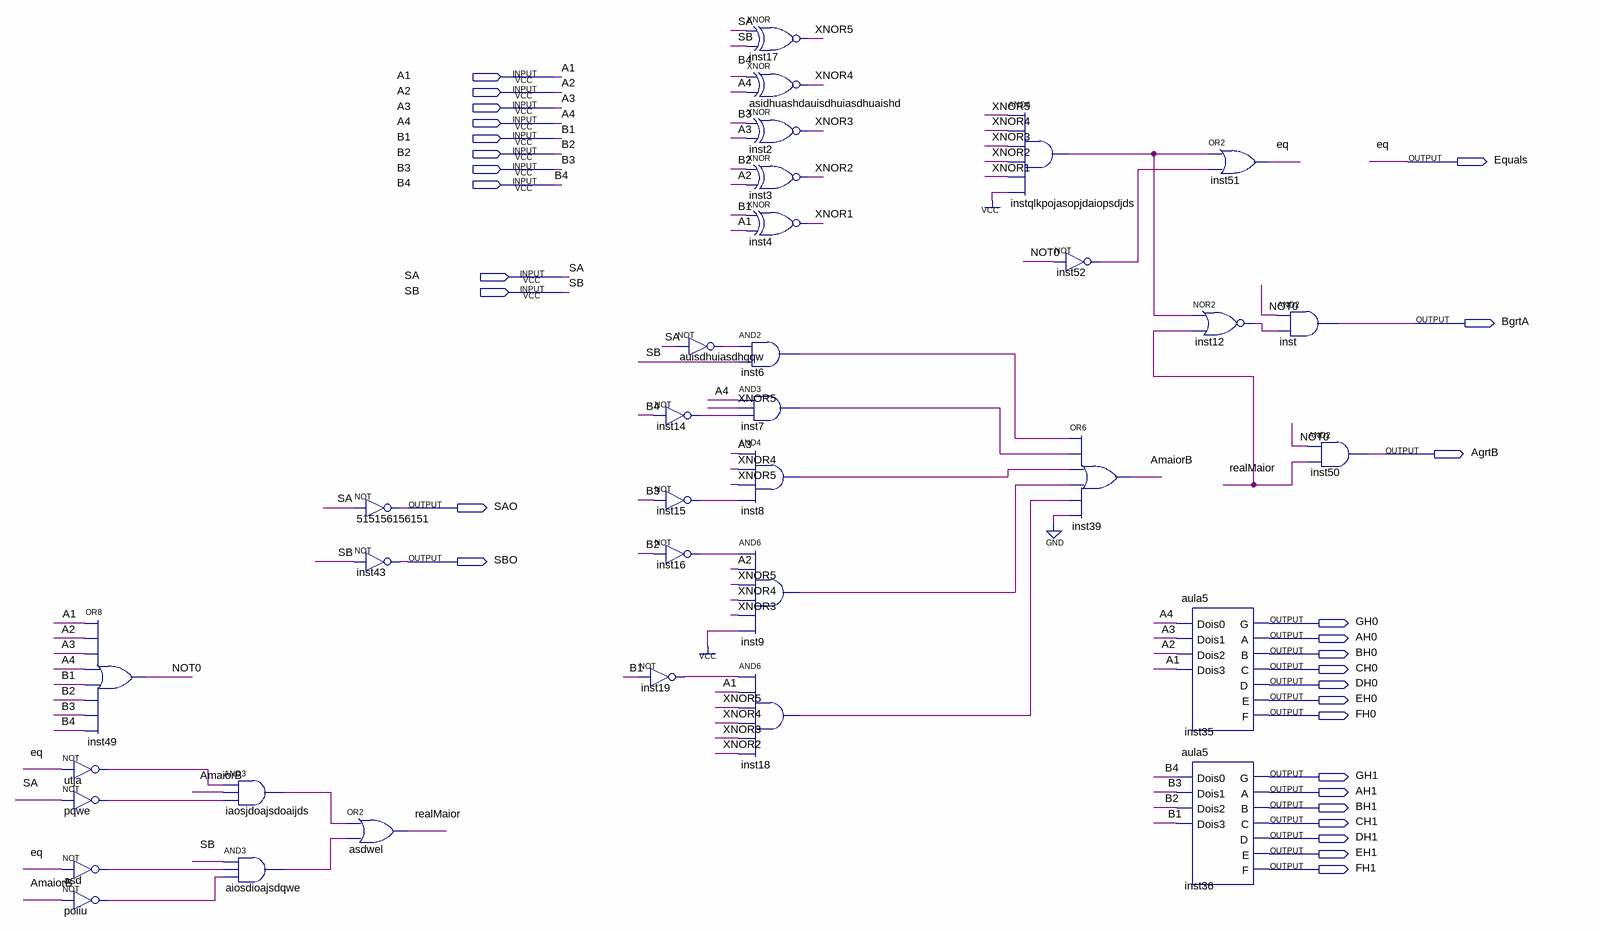
[diagram p0: schematic sheet]
// Quartus schematic aula13.bdf as structural Verilog: 34 symbols, 29 pins
module aula13 (
  input  A1,
  input  A2,
  input  A3,
  input  A4,
  input  B1,
  input  B2,
  input  B3,
  input  B4,
  input  SA,
  input  SB,
  output Equals,
  output BgrtA,
  output AgrtB,
  output SAO,
  output SBO,
  output GH0,
  output AH0,
  output BH0,
  output CH0,
  output DH0,
  output EH0,
  output FH0,
  output GH1,
  output AH1,
  output BH1,
  output CH1,
  output DH1,
  output EH1,
  output FH1
);

  wire aiosdioajsdqwe_out, AmaiorB, asd_out, auisdhuiasdhqqw_out, iaosjdoajsdoaijds_out, inst6_out,
       inst7_out, inst8_out, inst9_out, inst12_out, inst14_out, inst15_out, inst16_out, inst18_out,
       inst19_out, inst52_out, instqlkpojasopjdaiopsdjds_out, NOT0, poiiu_out, pqwe_out, realMaior, utja_out,
       XNOR1, XNOR2, XNOR3, XNOR4, XNOR5;

  or inst49 (NOT0, A1, A2, A3, A4, B1, B2, B3, B4);
  not utja (utja_out, Equals);
  not pqwe (pqwe_out, SA);
  not asd (asd_out, Equals);
  not poiiu (poiiu_out, AmaiorB);
  and iaosjdoajsdoaijds (iaosjdoajsdoaijds_out, utja_out, AmaiorB, pqwe_out);
  and aiosdioajsdqwe (aiosdioajsdqwe_out, SB, asd_out, poiiu_out);
  not u_515156156151 (SAO, SA);
  not inst43 (SBO, SB);
  or asdwel (realMaior, iaosjdoajsdoaijds_out, aiosdioajsdqwe_out);
  not inst19 (inst19_out, B1);
  not auisdhuiasdhqqw (auisdhuiasdhqqw_out, SA);
  not inst14 (inst14_out, B4);
  not inst15 (inst15_out, B3);
  not inst16 (inst16_out, B2);
  xnor inst17 (XNOR5, SA, SB);
  xnor asidhuashdauisdhuiasdhuaishd (XNOR4, B4, A4);
  xnor inst2 (XNOR3, B3, A3);
  xnor inst3 (XNOR2, B2, A2);
  xnor inst4 (XNOR1, B1, A1);
  and inst6 (inst6_out, auisdhuiasdhqqw_out, SB);
  and inst7 (inst7_out, A4, XNOR5, inst14_out);
  and inst8 (inst8_out, A3, XNOR4, XNOR5, inst15_out);
  and inst9 (inst9_out, inst16_out, A2, XNOR5, XNOR4, XNOR3, 1'b1);
  and inst18 (inst18_out, inst19_out, A1, XNOR5, XNOR4, XNOR3, XNOR2);
  and instqlkpojasopjdaiopsdjds (instqlkpojasopjdaiopsdjds_out, XNOR5, XNOR4, XNOR3, XNOR2, XNOR1, 1'b1);
  not inst52 (inst52_out, NOT0);
  or inst39 (AmaiorB, inst6_out, inst7_out, inst8_out, inst9_out, inst18_out, 1'b0);
  nor inst12 (inst12_out, instqlkpojasopjdaiopsdjds_out, realMaior);
  aula5 inst35 (
    .Dois0(A4), .Dois1(A3), .Dois2(A2), .Dois3(A1), .G(GH0), .A(AH0), .B(BH0), .C(CH0), .D(DH0), .E(EH0),
    .F(FH0));
  aula5 inst36 (
    .Dois0(B4), .Dois1(B3), .Dois2(B2), .Dois3(B1), .G(GH1), .A(AH1), .B(BH1), .C(CH1), .D(DH1), .E(EH1),
    .F(FH1));
  or inst51 (Equals, instqlkpojasopjdaiopsdjds_out, inst52_out);
  and inst (BgrtA, NOT0, inst12_out);
  and inst50 (AgrtB, NOT0, realMaior);

  // Other names for the same wires on the sheet: eq = Equals
endmodule
